# Altium schematic sheet CLU_SSI.SchDoc
size 420 x 297 mm; Address1: Address1; Address2: Address2; Address3: Address3; Address4: Address4; DocumentNumber: АБВГ.123456.001 Э3; SheetNumber: 1; Scale: 1:1; DocumentType: Схема электрическая принципиальная; FirstReferrence: АБВГ.123456.001
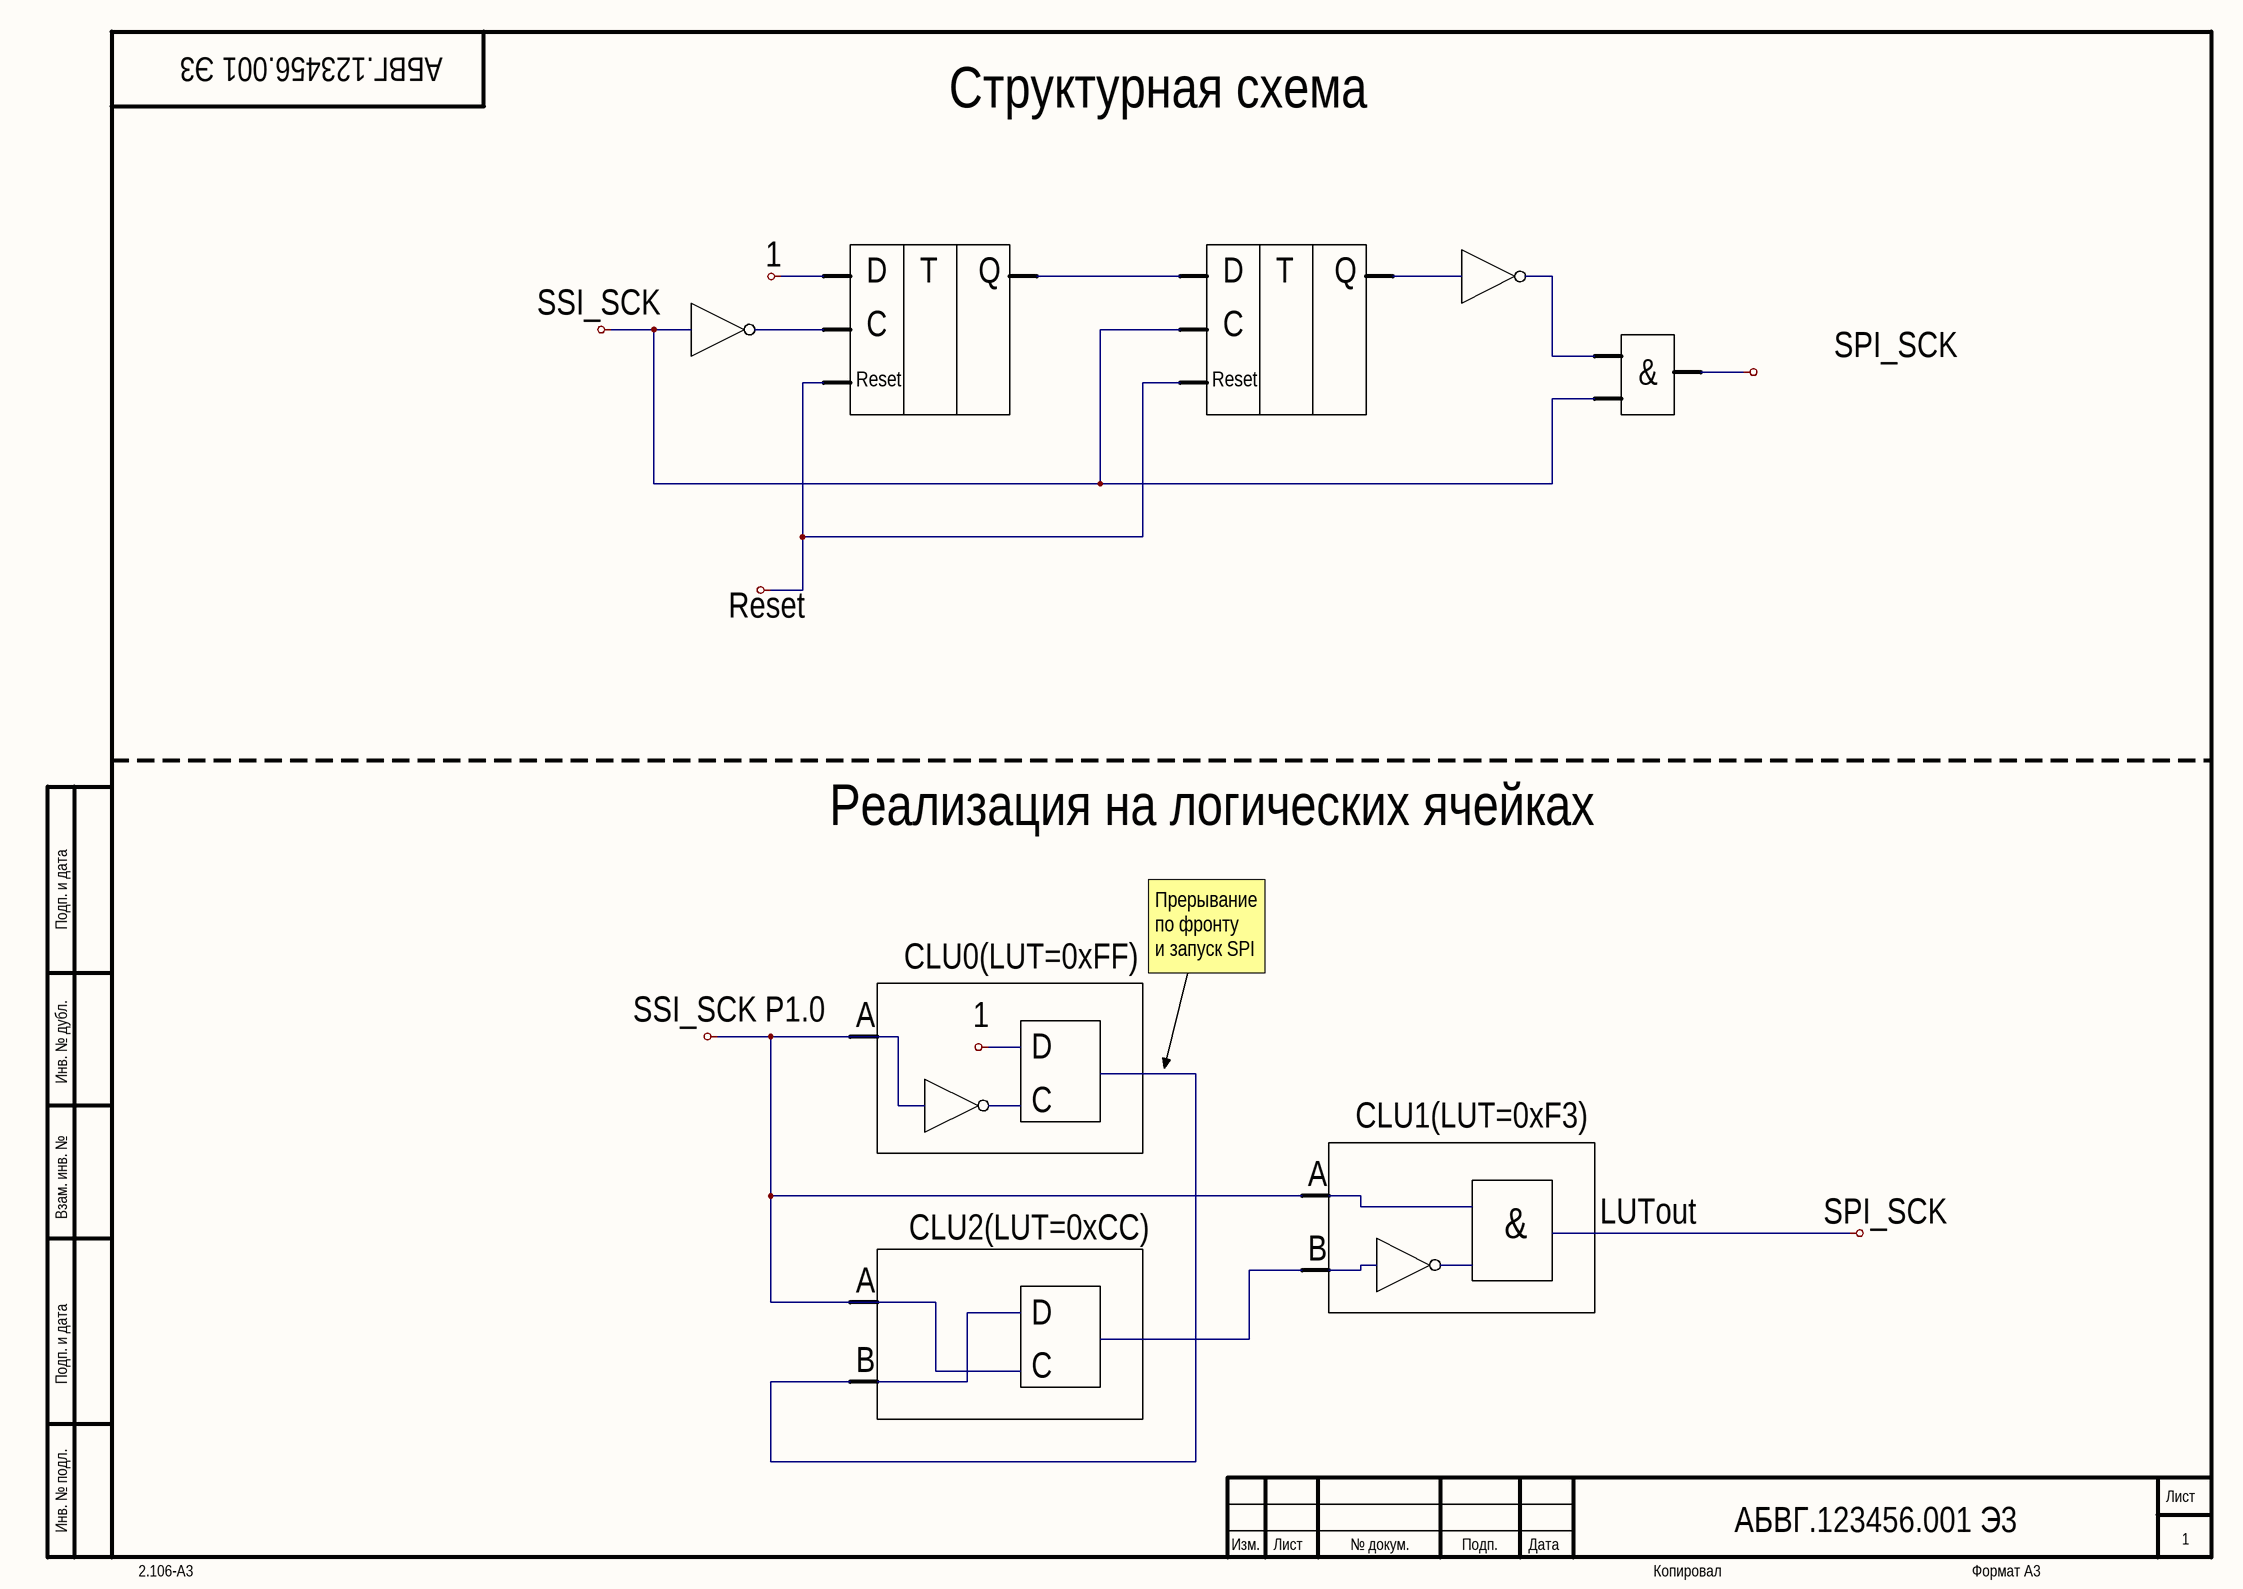
[diagram p0: CLU_SSI.SchDoc]

## Notes on the sheet
- Структурная схема
- SSI_SCK
- 1
- D
- T
- Q
- Reset
- C
- &
- SPI_SCK
- Реализация на логических ячейках
- CLU0(LUT=0xFF)
- Прерывание по фронту
  и запуск SPI
- SSI_SCK P1.0
- A
- CLU1(LUT=0xF3)
- CLU2(LUT=0xCC)
- B
- LUTout
- Подп. и дата
- Инв. № дубл.
- Взам. инв. №
- Инв. № подл.
- Изм.
- Лист
- № докум.
- Подп.
- Дата
- 2.106-A3
- Копировал
- Формат А3